# EAGLE schematic daisy_may (EAGLE 7.6.0)
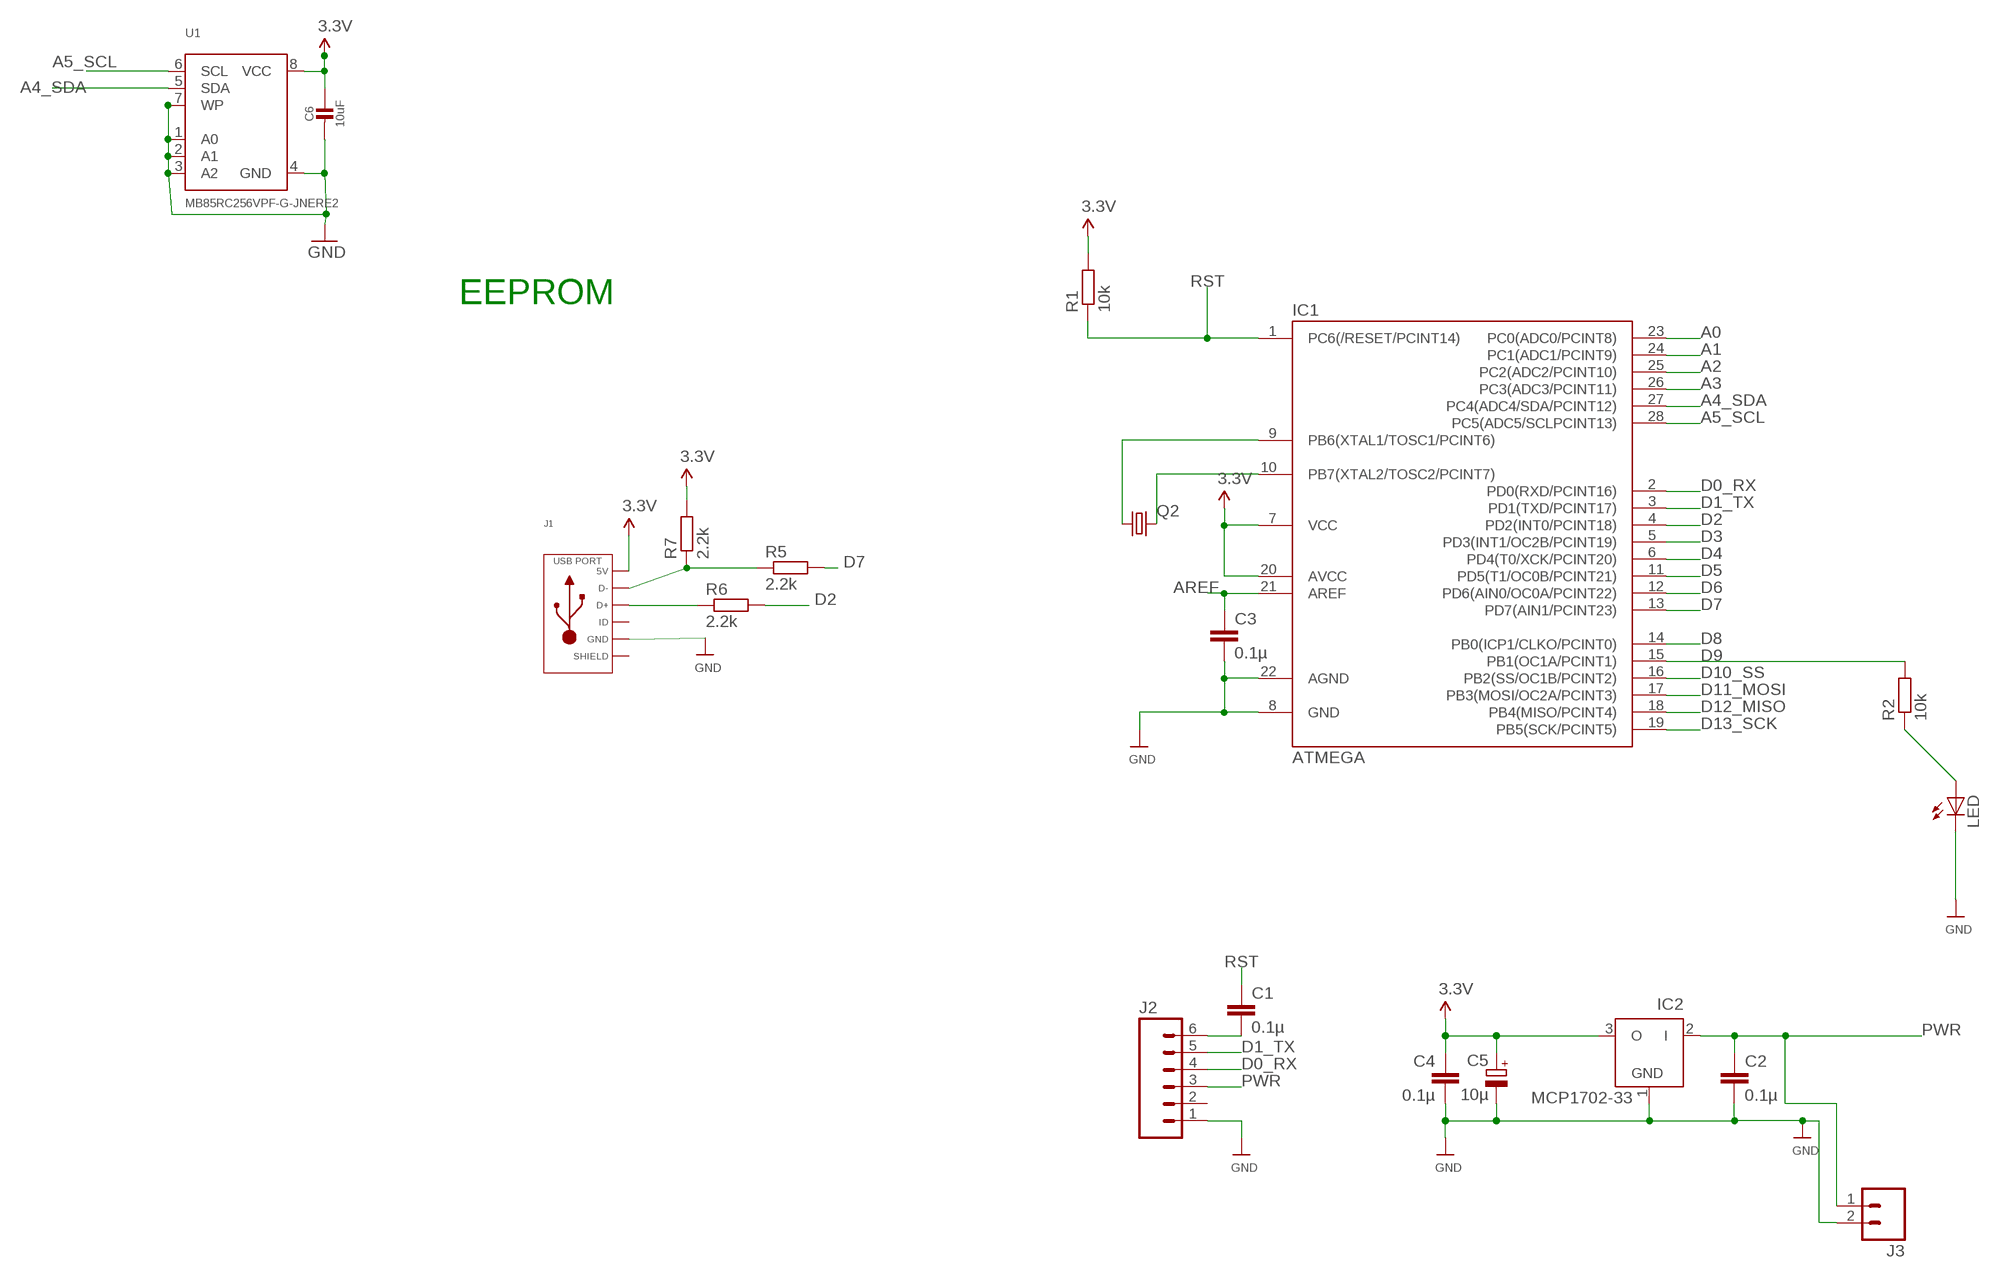
[diagram p0: schematic, sheet 1, part 1 of 2]
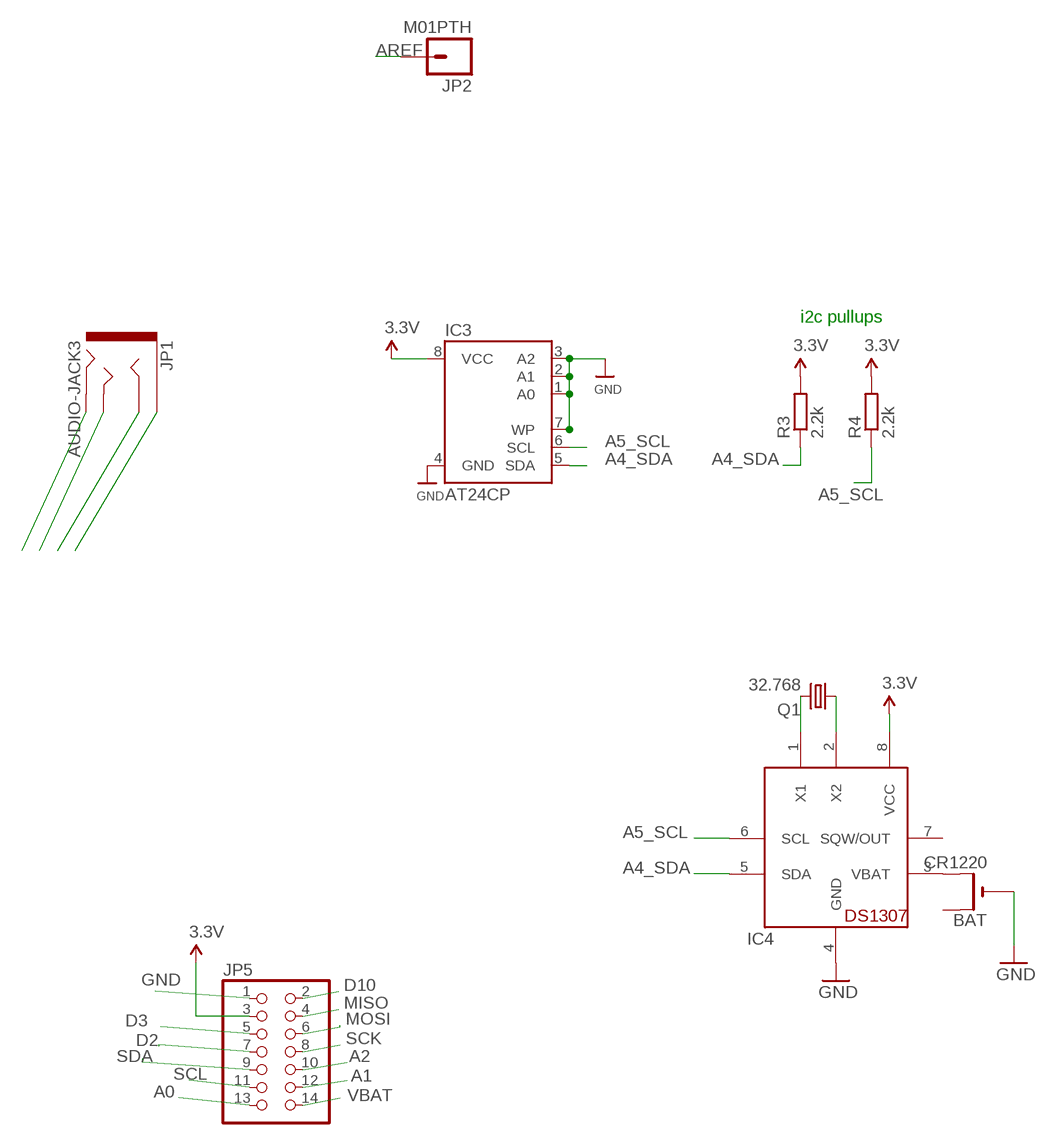
[diagram p1: schematic, sheet 1, part 2 of 2]

## Parts
BAT  CR1220  CR1220THM  [CR1220-THM]
C1  0.1µ  C-EU025-024X044  [C025-024X044]
C2  0.1µ  C-EU025-024X044  [C025-024X044]
C3  0.1µ  C-EU025-024X044  [C025-024X044]
C4  0.1µ  C-EU025-024X044  [C025-024X044]
C5  10µ  CPOL-EUE1.8-4  [E1,8-4]
C6  10uF  CAP_CERAMIC_0805MP  [_0805MP]
IC1  ATMEGA  ATMEGA48/88/168-PU  [DIL28-3]
IC2  MCP1702-33  MCP1702Z  [TO92]
IC3  AT24CP  [DIL08]
IC4  DS1307  [DIL08]
J1  USB_MICRO_RIGHT  [MICROUSB-RIGHT]
J2  M06SILK_FEMALE_PTH  [1X06]
J3  M02PTH  [1X02]
JP1  AUDIO-JACK3  [AUDIO-JACK-TRRS-SMD]
JP2  M01PTH  [1X01]
JP5  PINHD-2X7  [2X07]
LED  LED3MM  [LED3MM]
Q1  32.768  CRYTALTC38H  [TC38H]
Q2  CRYSTALHC49U70  [HC49U70]
R1  10k  R-EU_0204/7  [0204/7]
R2  10k  R-EU_0204/7  [0204/7]
R3  2.2k  R-EU_0204/7  [0204/7]
R4  2.2k  R-EU_0204/7  [0204/7]
R5  2.2k  R-EU_0204/7  [0204/7]
R6  2.2k  R-EU_0204/7  [0204/7]
R7  2.2k  R-EU_0204/7  [0204/7]
U1  MB85RC256VPF-G-JNERE2  FRAM_SOIC8_I2C  [SOIC8_208MIL]

## Nets
A0: IC1.23(PC0(ADC0/PCINT8)) JP5.13
A1: IC1.24(PC1(ADC1/PCINT9)) JP5.12
A2: IC1.25(PC2(ADC2/PCINT10)) JP5.10
A3: IC1.26(PC3(ADC3/PCINT11))
A4_SDA: IC1.27(PC4(ADC4/SDA/PCINT12)) IC3.5(SDA) IC4.5(SDA) R3.1 U1.5(SDA)
A5_SCL: IC1.28(PC5(ADC5/SCLPCINT13)) IC3.6(SCL) IC4.6(SCL) R4.1 U1.6(SCL)
AREF: C3.1 IC1.21(AREF) JP2.1
D0_RX: IC1.2(PD0(RXD/PCINT16)) J2.4
D1_TX: IC1.3(PD1(TXD/PCINT17)) J2.5
D2: IC1.4(PD2(INT0/PCINT18)) JP5.7 R6.2
D3: IC1.5(PD3(INT1/OC2B/PCINT19)) JP5.5
D4: IC1.6(PD4(T0/XCK/PCINT20))
D5: IC1.11(PD5(T1/OC0B/PCINT21))
D6: IC1.12(PD6(AIN0/OC0A/PCINT22))
D7: IC1.13(PD7(AIN1/PCINT23)) R5.2
D8: IC1.14(PB0(ICP1/CLKO/PCINT0))
D9: IC1.15(PB1(OC1A/PCINT1)) R2.2
D10: JP5.2
D10_SS: IC1.16(PB2(SS/OC1B/PCINT2))
D11_MOSI: IC1.17(PB3(MOSI/OC2A/PCINT3))
D12_MISO: IC1.18(PB4(MISO/PCINT4))
D13_SCK: IC1.19(PB5(SCK/PCINT5))
GND [power]: BAT.- C2.2 C3.2 C4.2 C5.- C6.2 IC1.8(GND) IC1.22(AGND) IC2.1(GND) IC3.1(A0) IC3.2(A1) IC3.3(A2) IC3.4(GND) IC3.7(WP) IC4.4(GND) J2.1 J3.2 JP5.1 LED.K(C) U1.1(A0) U1.2(A1) U1.3(A2) U1.4(GND) U1.7(WP)
MISO: JP5.4
MOSI: JP5.6
N$1: IC1.9(PB6(XTAL1/TOSC1/PCINT6)) Q2.1
N$2: LED.A R2.1
N$3: JP1.RING1
N$4: J1.2(D-) R5.1 R7.1
N$6: JP1.EARTH
N$8: JP1.TIP
N$9: JP1.RING2
N$12: J1.5(GND)
N$13: J1.3(D+) R6.1
N$14: IC4.1(X1) Q1.2
N$15: IC4.2(X2) Q1.1
N$20: C1.2 J2.6
N$21: IC1.10(PB7(XTAL2/TOSC2/PCINT7)) Q2.2
N$39: BAT.+2(+1) IC4.3(VBAT)
PWR [power]: C2.1 IC2.2(I) J2.3 J3.1
RST: C1.1 IC1.1(PC6(/RESET/PCINT14)) R1.1
SCK: JP5.8
SCL: JP5.11
SDA: JP5.9
VBAT [power]: JP5.14
VCC [power]: C4.1 C5.+ C6.1 IC1.7(VCC) IC1.20(AVCC) IC2.3(O) IC3.8(VCC) IC4.8(VCC) J1.1(5V) JP5.3 R1.2 R3.2 R4.2 R7.2 U1.8(VCC) ; supply symbol labelled 3.3V
Unconnected: BAT.+1(+) IC4.7(SQW/OUT) J1.4(ID) J2.2

## Notes on the sheet
- EEPROM
- i2c pullups

## Power pins joined to a net without a drawn wire
SLD: J1.S1(SLD) J1.S2(SLD) J1.S3(SLD) J1.S4(SLD) J1.S5(SLD) J1.S6(SLD) J1.S7(SLD) J1.S8(SLD)

## Library data of the parts
BAT = adafruit:CR1220: CR1216/CR1220/CR1225 12mm 3V lithium coin cell Great for battery packup. Both SMT and THM holders. Note the THM package has the ground pads on both sides of the PCB so that the masks are the same - this reduces the cost
C1-C4 = resistor:C-EU: CAPACITOR, European symbol
C5 = resistor:CPOL-EU: POLARIZED CAPACITOR, European symbol
C6 = microbuilder:CAP_CERAMIC: Ceramic Capacitors For new designs, use the packages preceded by an '_' character since they are more reliable: The following footprints should be used on most boards: _0402 - Standard footprint for regular board layouts _0603 - Standard footprint for regular board layouts _0805 - Standard footprint for regular board layouts _1206 - Standard footprint for regular board layouts For extremely tight-pitch boards where space is at a premium, the following 'micro-pitch' footprints can be used (smaller pads, no silkscreen outline, etc.): _0402MP - Micro-pitch footprint for very dense/compact boards _0603MP - Micro-pitch footprint for very dense/compact boards _0805MP - Micro-pitch footprint for very dense/compact boards _1206MP - Micro-pitch footprint for very dense/compact boards
IC1 = atmega8:ATMEGA48/88/168-PU
IC2 = JeeLabs:MCP1702: 200 mA, Low Power Low Dropout Voltage Regulator
IC3 = atmel:AT24C*: 2-wire serial EEPROM; MPN: AT24C1024BW-SH-B; OC_FARNELL: 1362646; OC_NEWARK: 03P2044
IC4 = adafruit:DS1307: DS1307 Real time clock (RTC) with battery backup ability. Talk to it via i2c
J1 = MF_Connectors:USB: Library: MF_Connectors Description: 5 Pin USB Connectors. SLD is the shield connection. Usually tied to ground through a small ferrite bead.
J2 = SparkFun-Connectors:M06: Header 6 Standard 6-pin 0.1" header. Use with straight break away headers (SKU : PRT-00116), right angle break away headers (PRT-00553), swiss pins (PRT-00743), machine pins (PRT-00117), and female headers (PRT-00115). Molex polarized connector foot print use with SKU : PRT-08094 with associated crimp pins and housings. NOTES ON THE VARIANTS LOCK and LOCK_LONGPADS... This footprint was designed to help hold the alignment of a through-hole component (i.e. 6-pin header) while soldering it into place. You may notice that each hole has been shifted either up or down by 0.005 of an inch from it's more standard position (which is a perfectly straight line). This slight alteration caused the pins (the squares in the middle) to touch the edges of the holes. Because they are alternating, it causes a "brace" to hold the component in place. 0.005 has proven to be the perfect amount of "off-center" position when using our standard breakaway headers. Although looks a little odd when you look at the bare footprint, once you have a header in there, the alteration is very hard to notice. Also,if you push a header all the way into place, it is covered up entirely on the bottom side. This idea of altering the position of holes to aid alignment will be further integrated into the Sparkfun Library for other footprints. It can help hold any component with 3 or more connection pins.; PROD_ID: CONN-08437
J3 = SparkFun-Connectors:M02: Standard 2-pin 0.1" header. Use with - straight break away headers ( PRT-00116) - right angle break away headers (PRT-00553) - swiss pins (PRT-00743) - machine pins (PRT-00117) - female headers (PRT-00115) Molex polarized connector foot print use with: PRT-08233 with associated crimp pins and housings. 2.54_SCREWTERM for use with PRT-10571. 3.5mm Screw Terminal footprints for PRT-08084 5mm Screw Terminal footprints for use with PRT-08432
JP1 = SparkFun-Connectors:AUDIO-JACK3: Audio jack - 3.5mm TRRS variety - two rings.
JP2 = SparkFun-Connectors:M01: Header 1 Standard 1-pin 0.1" header. Use with straight break away headers (SKU : PRT-00116), right angle break away headers (PRT-00553), swiss pins (PRT-00743), machine pins (PRT-00117), and female headers (PRT-00115).
JP5 = pinhead:PINHD-2X7: PIN HEADER
LED = led:LED: LED OSRAM: - CHIPLED LG R971, LG N971, LY N971, LG Q971, LY Q971, LO R971, LY R971 LH N974, LH R974 LS Q976, LO Q976, LY Q976 LO Q996 - Hyper CHIPLED LW Q18S LB Q993, LB Q99A, LB R99A - SideLED LS A670, LO A670, LY A670, LG A670, LP A670 LB A673, LV A673, LT A673, LW A673 LH A674 LY A675 LS A676, LA A676, LO A676, LY A676, LW A676 LS A679, LY A679, LG A679 - Hyper Micro SIDELED® LS Y876, LA Y876, LO Y876, LY Y876 LT Y87S - SmartLED LW L88C, LW L88S LB L89C, LB L89S, LG L890 LS L89K, LO L89K, LY L89K LS L896, LA L896, LO L896, LY L896 - TOPLED LS T670, LO T670, LY T670, LG T670, LP T670 LSG T670, LSP T670, LSY T670, LOP T670, LYG T670 LG T671, LOG T671, LSG T671 LB T673, LV T673, LT T673, LW T673 LH T674 LS T676, LA T676, LO T676, LY T676, LB T676, LH T676, LSB T676, LW T676 LB T67C, LV T67C, LT T67C, LS T67K, LO T67K, LY T67K, LW E67C LS E67B, LA E67B, LO E67B, LY E67B, LB E67C, LV E67C, LT E67C LW T67C LS T679, LY T679, LG T679 LS T770, LO T770, LY T770, LG T770, LP T770 LB T773, LV T773, LT T773, LW T773 LH T774 LS E675, LA E675, LY E675, LS T675 LS T776, LA T776, LO T776, LY T776, LB T776 LHGB T686 LT T68C, LB T68C - Hyper Mini TOPLED® LB M676 - Mini TOPLED Santana® LG M470 LS M47K, LO M47K, LY M47K Source: http://www.osram.convergy.de LUXEON: - LUMILED® LXK2-PW12-R00, LXK2-PW12-S00, LXK2-PW14-U00, LXK2-PW14-V00 LXK2-PM12-R00, LXK2-PM12-S00, LXK2-PM14-U00 LXK2-PE12-Q00, LXK2-PE12-R00, LXK2-PE12-S00, LXK2-PE14-T00, LXK2-PE14-U00 LXK2-PB12-K00, LXK2-PB12-L00, LXK2-PB12-M00, LXK2-PB14-N00, LXK2-PB14-P00, LXK2-PB14-Q00 LXK2-PR12-L00, LXK2-PR12-M00, LXK2-PR14-Q00, LXK2-PR14-R00 LXK2-PD12-Q00, LXK2-PD12-R00, LXK2-PD12-S00 LXK2-PH12-R00, LXK2-PH12-S00 LXK2-PL12-P00, LXK2-PL12-Q00, LXK2-PL12-R00 Source: www.luxeon.com KINGBRIGHT: KA-3528ASYC Source: www.kingbright.com
Q1 = crystal:CRYTAL: CRYSTAL
Q2 = crystal:CRYSTAL: CRYSTAL; OC_FARNELL: unknown; OC_NEWARK: unknown
R1-R7 = resistor:R-EU_: RESISTOR, European symbol
U1 = microbuilder:FRAM_SOIC8_I2C: I2C FRAM - SOIC8 Package 256KBit (32Kx8) - MB85RC256VPF-G-JNERE2 - SOIC-8 200 Mil, 2.7-5.5V, -40°C-85°C

## Net classes
1 power: width 0.305 mm